# Altium schematic sheet UART.SCHDOC: FPGA Rack
size 420 x 297 mm; DrawnBy: zas; Revision: V1.0; SheetNumber: 12; SheetTotal: 25; DocumentName: UART.SCHDOC
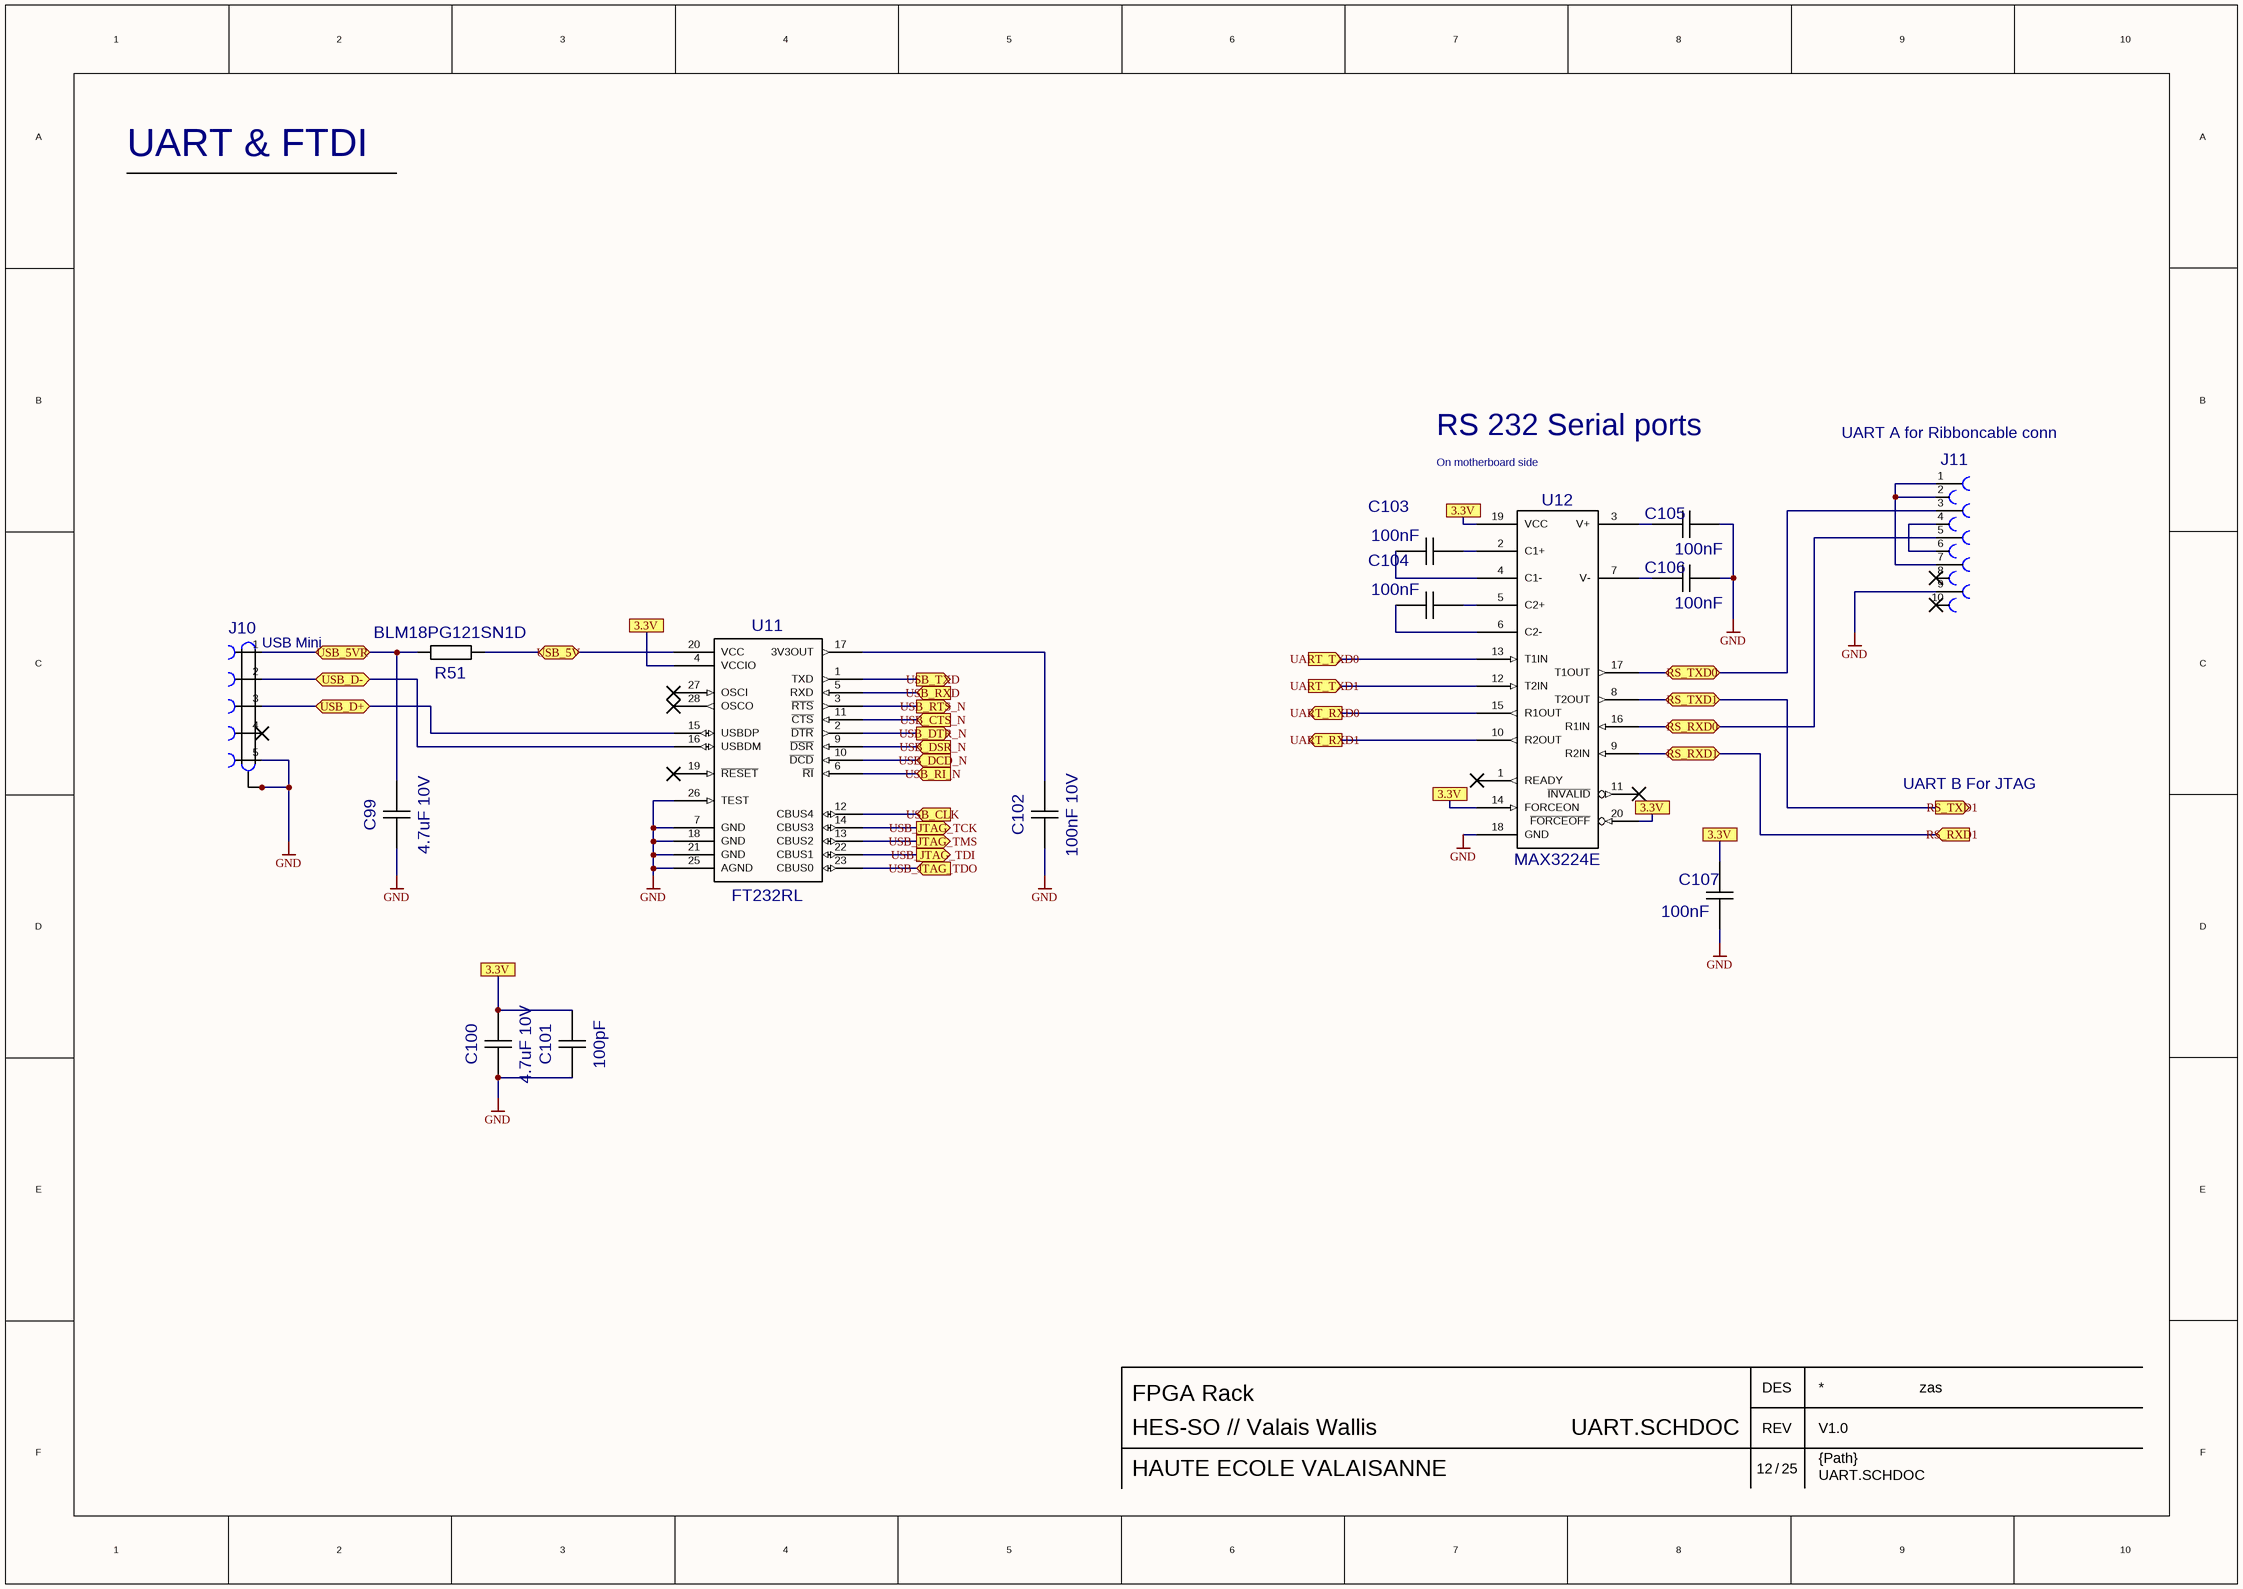
[diagram p0: UART.SCHDOC]

## Parts
C99  value 4.7uF 10V  [CC0805-MM]  (hidden comment: CAPS0805-MM)
C100  value 4.7uF 10V  [CC0805-MM]  (hidden comment: CAPS0805-MM)
C101  value 100pF  [CC0805-MM]  (hidden comment: CAPS0805-MM)
C102  value 100nF 10V  [CC0805-MM]  (hidden comment: CAPS0805-MM)
C103  value 100nF  [CC0805-MM]  (hidden comment: CAPS0805-MM)
C104  value 100nF  [CC0805-MM]  (hidden comment: CAPS0805-MM)
C105  value 100nF  [CC0805-MM]  (hidden comment: CAPS0805-MM)
C106  value 100nF  [CC0805-MM]  (hidden comment: CAPS0805-MM)
C107  value 100nF  [CC0805-MM]  (hidden comment: CAPS0805-MM)
J10  value USB Mini  [USB-MINI-B-SMD]  (hidden comment: USB-MINI-B-SMD)
J11  CONNB2X5  [CONN2X5]  (value not drawn)
R51  value BLM18PG121SN1D  [RC0603-MM]  (hidden comment: RS0603-MM)
U11  FT232RL  [SSOP28-P0.65-L10.2-C5.4]
U12  MAX3224E  [SSOP20]

## Ports
3.3V, RS_RXD0 (bidir), RS_RXD1 (bidir), RS_RXD1 (in), RS_TXD0 (bidir), RS_TXD1 (bidir), RS_TXD1 (out), UART_RXD0 (out), UART_RXD1 (out), UART_TXD0 (in), UART_TXD1 (in), USB_5V (bidir), USB_5VR (bidir), USB_CLK (in), USB_CTS_N (in), USB_D+ (bidir), USB_D- (bidir), USB_DCD_N (in), USB_DSR_N (in), USB_DTR_N (out), USB_JTAG_TCK (out), USB_JTAG_TDI (out), USB_JTAG_TDO (in), USB_JTAG_TMS (out), USB_RI_N (in), USB_RTS_N (out), USB_RXD (in), USB_TXD (out)

## Nets
GND: C99.1 C100.1 C101.1 C102.1 C105.2 C106.2 C107.1 J10.5(GND) J10.6(CASE) J10.7(CASE) J10.8(CASE) J10.9(CASE) J11.9 U11.7(GND) U11.18(GND) U11.21(GND) U11.25(AGND) U11.26(TEST) U12.18(GND)
RS_RXD0: J11.5 U12.16(R1IN) ; port RS_RXD0
RS_RXD1: U12.9(R2IN) ; port RS_RXD1
RS_TXD0: J11.3 U12.17(T1OUT) ; port RS_TXD0
RS_TXD1: U12.8(T2OUT) ; port RS_TXD1
UART_RXD0: U12.15(R1OUT) ; port UART_RXD0
UART_RXD1: U12.10(R2OUT) ; port UART_RXD1
UART_TXD0: U12.13(T1IN) ; port UART_TXD0
UART_TXD1: U12.12(T2IN) ; port UART_TXD1
USB_5V: R51.1 U11.20(VCC) ; port USB_5V
USB_5VR: C99.2 J10.1(VBUS) R51.2 ; port USB_5VR
USB_CLK: U11.12(CBUS4) ; port USB_CLK
USB_CTS_N: U11.11(~{CTS}) ; port USB_CTS_N
USB_D+: J10.3(D+) U11.15(USBDP) ; port USB_D+
USB_D-: J10.2(D-) U11.16(USBDM) ; port USB_D-
USB_DCD_N: U11.10(~{DCD}) ; port USB_DCD_N
USB_DSR_N: U11.9(~{DSR}) ; port USB_DSR_N
USB_DTR_N: U11.2(~{DTR}) ; port USB_DTR_N
USB_JTAG_TCK: U11.14(CBUS3) ; port USB_JTAG_TCK
USB_JTAG_TDI: U11.22(CBUS1) ; port USB_JTAG_TDI
USB_JTAG_TDO: U11.23(CBUS0) ; port USB_JTAG_TDO
USB_JTAG_TMS: U11.13(CBUS2) ; port USB_JTAG_TMS
USB_RI_N: U11.6(~{RI}) ; port USB_RI_N
USB_RTS_N: U11.3(~{RTS}) ; port USB_RTS_N
USB_RXD: U11.5(RXD) ; port USB_RXD
USB_TXD: U11.1(TXD) ; port USB_TXD
NetC100_2: C100.2 C101.2
NetC102_2: C102.2 U11.17(3V3OUT)
NetC103_1: C103.1 U12.4(C1-)
NetC103_2: C103.2 U12.2(C1+)
NetC104_1: C104.1 U12.6(C2-)
NetC104_2: C104.2 U12.5(C2+)
NetC105_1: C105.1 U12.3(V+)
NetC106_1: C106.1 U12.7(V-)
NetJ11_1: J11.1 J11.2 J11.7
NetJ11_4: J11.4 J11.6

Not connected (* = marked no-connect by the designer): C107 2; J10 4(ID) 10 11; J11 8 10; U11 4(VCCIO) 8 19(~{RESET}) 24 27(OSCI) 28(OSCO); U12 1(READY) 11(~{INVALID}) 14(FORCEON) 19(VCC) 20(~{FORCEOFF})

## Notes on the sheet
- UART & FTDI
- RS 232 Serial ports
- (near J11) UART A for Ribboncable conn
- On motherboard side
- UART B For JTAG
- DES
- HES-SO // Valais Wallis
- HAUTE ECOLE VALAISANNE
- /
- REV
- {Path}

## Library data of the parts
C99-C102 = CAPS0805-MM: Capacitor
C103-C107 = CAPS0805-MM: Capacitor; Partition: Shared IOs; RefDes2: {RefDes2}
J10 = USB-MINI-B-SMD: Farnell no 1125-348 / Molex SD-67503-010
J11 = CONNB2X5: use: cpu jtag; Value: *
U11 = FT232RL: 24-Bit ADC with Ultra Low Noise PGIA - Crystal; Value: FT232RL
U12 = MAX3224E: +/- 15kV ESD-Protected, 1uA, 1Mbps, 3.0V to 5.5V, RS-232 Transceiver with AutoShutdown Plus; Partition: Shared IOs; RefDes2: {RefDes2}; Value: *